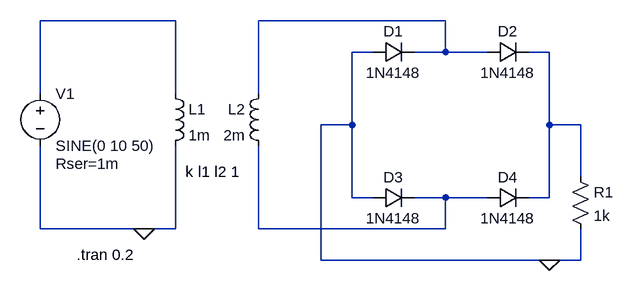
[diagram p0: schematic 3-fw.asc]
3-fw.asc, the LTspice schematic file:
Version 4.1
SHEET 1 880 680
WIRE 144 16 -64 16
WIRE 560 16 272 16
WIRE 448 64 416 64
WIRE 560 64 560 16
WIRE 560 64 512 64
WIRE 624 64 560 64
WIRE 720 64 688 64
WIRE -64 128 -64 16
WIRE 144 128 144 16
WIRE 272 128 272 16
WIRE 416 176 416 64
WIRE 416 176 368 176
WIRE 720 176 720 64
WIRE 768 176 720 176
WIRE 768 256 768 176
WIRE 416 288 416 176
WIRE 448 288 416 288
WIRE 560 288 512 288
WIRE 624 288 560 288
WIRE 720 288 720 176
WIRE 720 288 688 288
WIRE -64 336 -64 208
WIRE 96 336 -64 336
WIRE 144 336 144 208
WIRE 144 336 96 336
WIRE 272 336 272 208
WIRE 560 336 560 288
WIRE 560 336 272 336
WIRE 368 384 368 176
WIRE 720 384 368 384
WIRE 768 384 768 336
WIRE 768 384 720 384
FLAG 96 336 0
FLAG 720 384 0
SYMBOL voltage -64 112 R0
WINDOW 123 0 0 Left 0
WINDOW 39 24 124 Left 2
SYMATTR InstName V1
SYMATTR Value SINE(0 10 50)
SYMATTR SpiceLine Rser=1m
SYMBOL ind 128 112 R0
SYMATTR InstName L1
SYMATTR Value 1m
SYMATTR Type ind
SYMBOL ind 288 112 M0
SYMATTR InstName L2
SYMATTR Value 2m
SYMATTR Type ind
SYMBOL diode 448 80 R270
WINDOW 0 32 32 VTop 2
WINDOW 3 0 32 VBottom 2
SYMATTR InstName D1
SYMATTR Value 1N4148
SYMBOL res 752 240 R0
SYMATTR InstName R1
SYMATTR Value 1k
SYMBOL diode 624 80 R270
WINDOW 0 32 32 VTop 2
WINDOW 3 0 32 VBottom 2
SYMATTR InstName D2
SYMATTR Value 1N4148
SYMBOL diode 448 304 R270
WINDOW 0 32 32 VTop 2
WINDOW 3 0 32 VBottom 2
SYMATTR InstName D3
SYMATTR Value 1N4148
SYMBOL diode 624 304 R270
WINDOW 0 32 32 VTop 2
WINDOW 3 0 32 VBottom 2
SYMATTR InstName D4
SYMATTR Value 1N4148
TEXT 160 248 Left 2 !k l1 l2 1
TEXT -8 376 Left 2 !.tran 0.2

The netlist it stands for:
* 3-fw.asc
V1 N001 0 SINE(0 10 50) Rser=1m
L1 N001 0 1m
L2 N002 N004 2m
D1 0 N002 1N4148
R1 N003 0 1k
D2 N002 N003 1N4148
D3 0 N004 1N4148
D4 N004 N003 1N4148
.model D D
.lib standard.dio
k l1 l2 1
.tran 0.2
.backanno
.end